# Altium project ESP8266ProgrammeBoard.PrjPcb
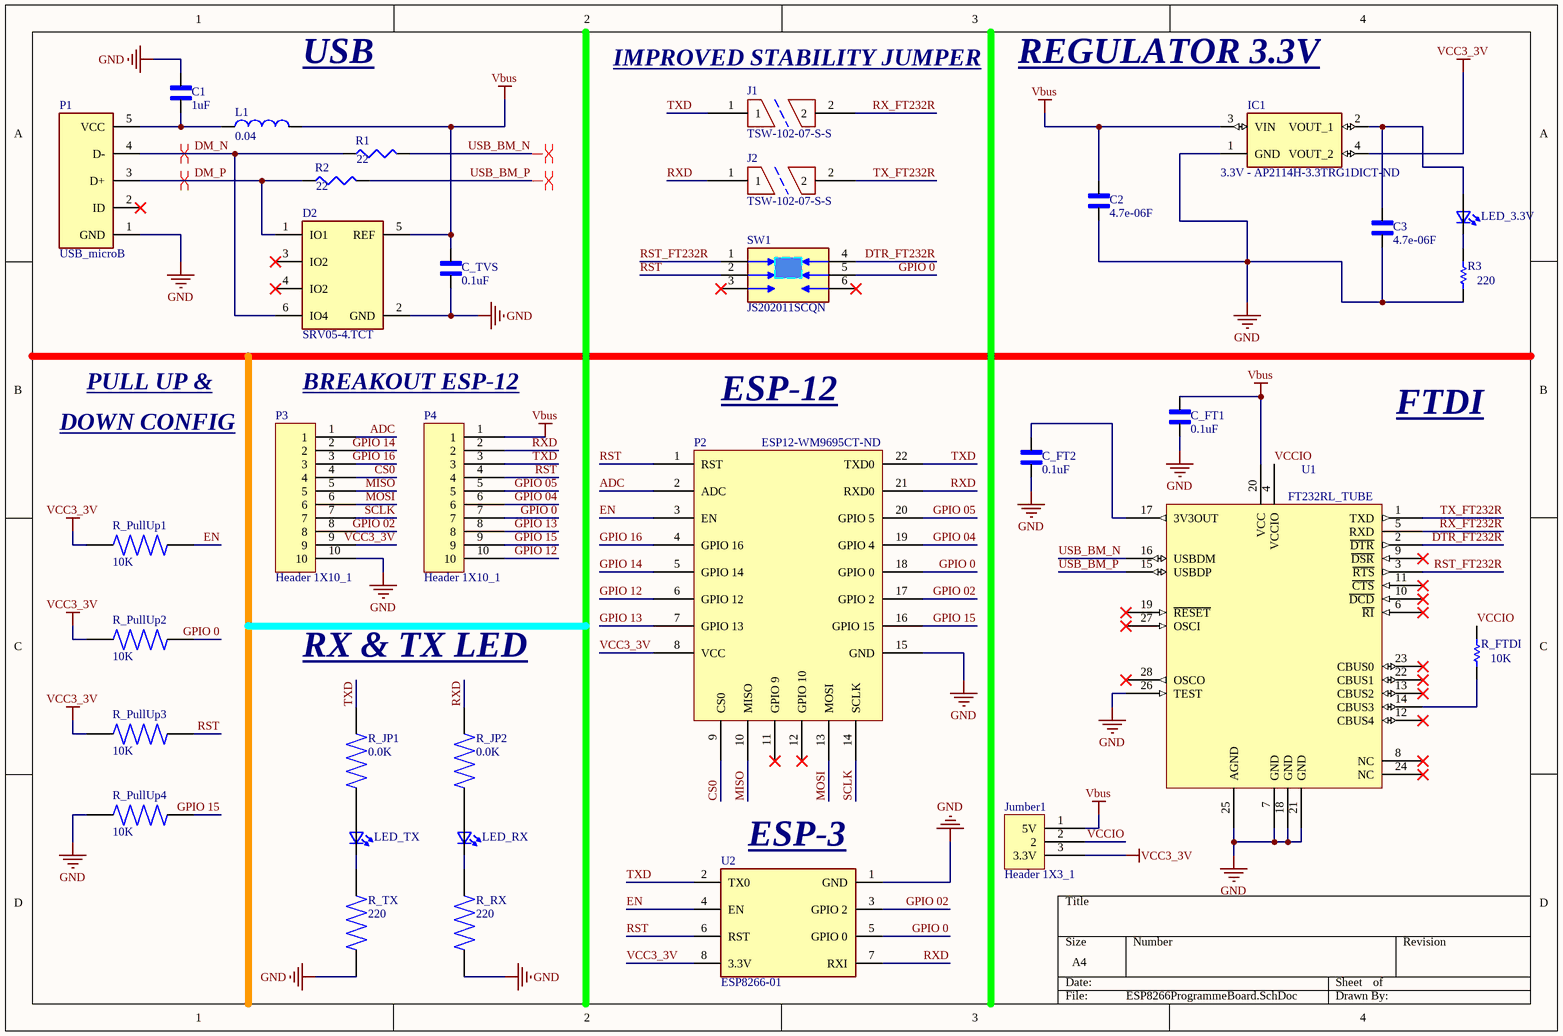
[diagram p0: ESP8266ProgrammeBoard.SchDoc]
1 sheet, 34 parts. Net scope: global (net labels, ports and power ports of the same name join across sheets).
Board file: ESP8266ProgrammeBoard.PcbDoc

## Sheet ESP8266ProgrammeBoard.SchDoc
size A4; SheetNumber: 1; SheetTotal: 1; SPICEModelCacheGZBLNQVD: <root> / <DocumentId>GZBLNQVD</DocumentId> / </root>

### Parts
C1  1uF  [CAPC2012X130N]
C2  4.7e-06F  [CAPC2012X130N]
C3  4.7e-06F  [CAPC2012X130N]
C_FT1  0.1uF  [CAPC2012X130N]
C_FT2  0.1uF  [CAPC2012X130N]
C_TVS  0.1uF  [CAPC2012X130N]
D2  SRV05-4.TCT  [SRV05-4.TCT]
IC1  3.3V - AP2114H-3.3TRG1DICT-ND  [AP2114H-3.3TRG1]
J1  TSW-102-07-S-S  [TSW-102-07-S-S]
J2  TSW-102-07-S-S  [TSW-102-07-S-S]
Jumber1  Header 1X3_1  [Header 1X3_1]
L1  0.04  [WE-CBF_0603_W2.6]
LED_3.3V  LTST-C191KRKT  [0603]  (value not drawn)
LED_RX  LTST-C191KRKT  [0603]  (value not drawn)
LED_TX  LTST-C191KRKT  [0603]  (value not drawn)
P1  USB_microB  [Reversed_USB_microB]
P2  ESP12-WM9695CT-ND  [ESP8266-ESP12]
P3  Header 1X10_1  [Header 1X10_1]
P4  Header 1X10_1  [Header 1X10_1]
R1  value 22  [J1-0603]  (hidden comment: Res3)
R2  value 22  [J1-0603]  (hidden comment: Res3)
R3  value 220  [RESC1608X55N]  (hidden comment: Res1)
R_FTDI  value 10K  [RESC1608X55N]  (hidden comment: Res1)
R_JP1  0.0K  [RESC1608X55N]
R_JP2  0.0K  [RESC1608X55N]
R_PullUp1  10K  [RESC1608X55N]
R_PullUp2  10K  [RESC1608X55N]
R_PullUp3  10K  [RESC1608X55N]
R_PullUp4  10K  [RESC1608X55N]
R_RX  220  [RESC1608X55N]
R_TX  220  [RESC1608X55N]
SW1  JS202011SCQN  [SW_JS202011SCQN]
U1  FT232RL_TUBE  [FT232RL_TUBE]
U2  ESP8266-01  [ESP8266-01/ESP-01]

### Nets
GND: C1.2 C2.1 C3.1 C_FT1.1 C_FT2.1 C_TVS.1 D2.2(GND) IC1.1(GND) P1.1(GND) P2.15(GND) P3.10 R3.1 R_PullUp4.1 R_RX.1 R_TX.1 U1.7(GND) U1.18(GND) U1.21(GND) U1.25(AGND) U1.26(TEST) U2.1(GND)
Vbus: C2.2 C_FT1.2 C_TVS.2 D2.5(REF) IC1.3(VIN) Jumber1.1(5V) L1.2 P4.1 U1.20(VCC)
VCC3_3V: IC1.4(VOUT_2) Jumber1.3(3.3V) P2.8(VCC) P3.9 R_PullUp1.1 R_PullUp2.1 R_PullUp3.1 U2.8(3.3V)
ADC: P2.2(ADC) P3.1
CS0: P2.9(CS0) P3.4
DM_N: D2.6(IO4) P1.4(D-) R1.1
DM_P: D2.1(IO1) P1.3(D+) R2.1
DTR_FT232R: SW1.4 U1.2(~{DTR})
EN: P2.3(EN) R_PullUp1.2 U2.4(EN)
GPIO 0: P2.18(GPIO_0) P4.7 R_PullUp2.2 SW1.5 U2.5(GPIO_0)
GPIO 02: P2.17(GPIO_2) P3.8 U2.3(GPIO_2)
GPIO 04: P2.19(GPIO_4) P4.6
GPIO 05: P2.20(GPIO_5) P4.5
GPIO 12: P2.6(GPIO_12) P4.10
GPIO 13: P2.7(GPIO_13) P4.8
GPIO 14: P2.5(GPIO_14) P3.2
GPIO 15: P2.16(GPIO_15) P4.9 R_PullUp4.2
GPIO 16: P2.4(GPIO_16) P3.3
MISO: P2.10(MISO) P3.5
MOSI: P2.13(MOSI) P3.6
RST: P2.1(RST) P4.4 R_PullUp3.2 SW1.2 U2.6(RST)
RST_FT232R: SW1.1 U1.3(~{RTS})
RX_FT232R: J1.2 U1.5(RXD)
RXD: J2.1 P2.21(RXD0) P4.2 R_JP2.2 U2.7(RXI)
SCLK: P2.14(SCLK) P3.7
TX_FT232R: J2.2 U1.1(TXD)
TXD: J1.1 P2.22(TXD0) P4.3 R_JP1.2 U2.2(TX0)
USB_BM_N: R1.2 U1.16(USBDM)
USB_BM_P: R2.2 U1.15(USBDP)
VCCIO: Jumber1.2 R_FTDI.2 U1.4(VCCIO)
NetC1_1: C1.1 L1.1 P1.5(VCC)
NetC3_2: C3.2 IC1.2(VOUT_1) LED_3.3V.2(A2)
NetC_FT2_2: C_FT2.2 U1.17(3V3OUT)
NetLED_3.3V_1: LED_3.3V.1(K2) R3.2
NetLED_RX_1: LED_RX.1(K2) R_RX.2
NetLED_RX_2: LED_RX.2(A2) R_JP2.1
NetLED_TX_1: LED_TX.1(K2) R_TX.2
NetLED_TX_2: LED_TX.2(A2) R_JP1.1
NetR_FTDI_1: R_FTDI.1 U1.14(CBUS3)

Not connected (* = marked no-connect by the designer): D2 3(IO2)* 4(IO2)*; P1 2(ID)*; P2 11(GPIO_9)* 12(GPIO_10)*; SW1 3* 6*; U1 6(~{RI})* 8(NC)* 9(~{DSR})* 10(~{DCD})* 11(~{CTS})* 12(CBUS4)* 13(CBUS2)* 19(~{RESET})* 22(CBUS1)* 23(CBUS0)* 24(NC)* 27(OSCI)* 28(OSCO)*

### Layout directives
differential pair: DM_N, DM_P, USB_BM_N, USB_BM_P

### Notes on the sheet
- USB
- (near J1) IMPROVED STABILITY JUMPER
- REGULATOR 3.3V
- DOWN CONFIG
- PULL UP &
- BREAKOUT ESP-12
- ESP-12
- FTDI
- RX & TX LED
- (near U2) ESP-3

### Library data of the parts
C1-C3 C_FT1 C_FT2 C_TVS = 0805Y0500104JXT: MF: {'manufacturer': u'Syfer'}; Package: None; Price: None; Value: *; MP: 0805Y0500104JXT; Availability: Unavailable
D2 = SRV05-4.TCT: Semtech SRV05-4.TCT, Uni-Directional TVS Diode Array, 300W, 6-Pin SOT-23
IC1 = AP2114H-3.3TRG1: Voltage Regulators, LDO, 1.5MHz CMOS LDO 2.5V to 5V 600mV | Diodes Inc AP2114H-3.3TRG1
J1 J2 = TSW-102-07-S-S: CONN HEADER 2POS .100" SGL GOLD
L1 = WE-CBF_0603: MF: {'manufacturer': u'Wurth Electronics'}; MP: 742792601; Package: None; Price: None; Value: *; Availability: Unavailable
LED_3.3V LED_RX LED_TX = LTST-C191KRKT: http://octopart.com/ltst-c190krkt-lite-on-549893; Package: None; MP: LTST-C191KRKT; Value: *; Availability: Unavailable; Price: None
P1 = Reversed_USB_microB: USB - micro B USB 2.0 Receptacle Connector 5 Position Surface Mount, Right Angle; Through Hole
R1 R2 = Res3: Resistor; Published: 8-Jun-2000; LatestRevisionDate: 29-May-2009; LatestRevisionNote: IPC-7351 Footprint Added.; PackageReference: J1-0603; Publisher: Altium Limited; PackageDescription: Chip Resistor
R3 R_FTDI = Res1: Resistor; Published: 8-Jun-2000; LatestRevisionDate: 17-Jul-2002; LatestRevisionNote: Re-released for DXP Platform.; PackageReference: AXIAL-0.3; Publisher: Altium Limited; PackageDescription: Axial Device, Thru-Hole; 2 Leads; 0.3 in Pin Spacing
R_JP1 R_JP2 R_PullUp1-R_PullUp4 R_RX R_TX = RK73G1JTTD1002F: MF: {'manufacturer': u'KOA Speer'}; Package: None; Price: None; Value: *; MP: RK73G1JTTD1002F; Availability: Unavailable
U1 = FT232RL_TUBE: FT232RL-Tube / USB UART Asynchronous Serial Data Transfer Chip, 28-pin SSOP, Tube
U2 = ESP8266-01_ESP-01: MakerFocus 4pcs ESP8266 ESP-01 Serial Wireless WiFi Transceiver Receiver Module 1MB SPI Flash DC3.0-3.6V Internet of Things WiFi Module Board Compatible with Ar duino